# Altium schematic sheet MemReadController.SchDoc
size A4; DocumentNumber: 9; SheetNumber: 9; SheetTotal: 10
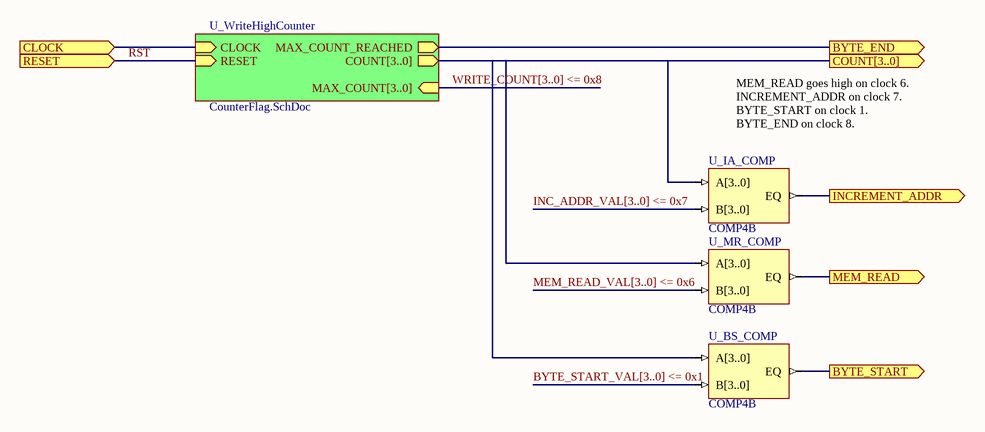
[diagram p0: MemReadController.SchDoc]

## Parts
U_BS_COMP  COMP4B
U_IA_COMP  COMP4B
U_MR_COMP  COMP4B

## Sub-sheets
U_WriteHighCounter = CounterFlag.SchDoc: CLOCK (in), RESET (in), MAX_COUNT_REACHED (out), COUNT[3..0] (out), MAX_COUNT[3..0] (in)

## Ports
BYTE_END (out), BYTE_START (out), CLOCK (in), COUNT[3..0] (out), INCREMENT_ADDR (out), MEM_READ (out), RESET (in)

## Nets
BYTE_END: port BYTE_END, sheet U_WriteHighCounter/MAX_COUNT_REACHED
BYTE_START: U_BS_COMP.EQ ; port BYTE_START
BYTE_START_VAL[3..0] <= 0x1: U_BS_COMP.B[3..0]
CLOCK: port CLOCK, sheet U_WriteHighCounter/CLOCK
COUNT[3..0]: U_BS_COMP.A[3..0] U_IA_COMP.A[3..0] U_MR_COMP.A[3..0] ; port COUNT[3..0], sheet U_WriteHighCounter/COUNT[3..0]
INC_ADDR_VAL[3..0] <= 0x7: U_IA_COMP.B[3..0]
INCREMENT_ADDR: U_IA_COMP.EQ ; port INCREMENT_ADDR
MEM_READ: U_MR_COMP.EQ ; port MEM_READ
MEM_READ_VAL[3..0] <= 0x6: U_MR_COMP.B[3..0]
RST: port RESET, sheet U_WriteHighCounter/RESET

## Buses and harness runs
bus BYTE_START_VAL[3..0] <= 0x1
bus INC_ADDR_VAL[3..0] <= 0x7
bus MEM_READ_VAL[3..0] <= 0x6
bus port COUNT[3..0] = sheet U_WriteHighCounter/COUNT[3..0]
bus WRITE_COUNT[3..0] <= 0x8 = sheet U_WriteHighCounter/MAX_COUNT[3..0]

## Notes on the sheet
- (near U_IA_COMP) MEM_READ goes high on clock 6.
  INCREMENT_ADDR on clock 7.
  BYTE_START on clock 1.
  BYTE_END on clock 8.

## Library data of the parts
U_BS_COMP U_IA_COMP U_MR_COMP = COMP4B: 4-Bit Identity Comparator, Bus Version; ArchiveName: GENERIC; VHDLIB_SIM: GENERIC_LIB; Published: 29-Jan-2004; Publisher: Altium Limited; Core Revision: 1.00.00